# Altium schematic sheet Power_Tree.SchDoc
size A
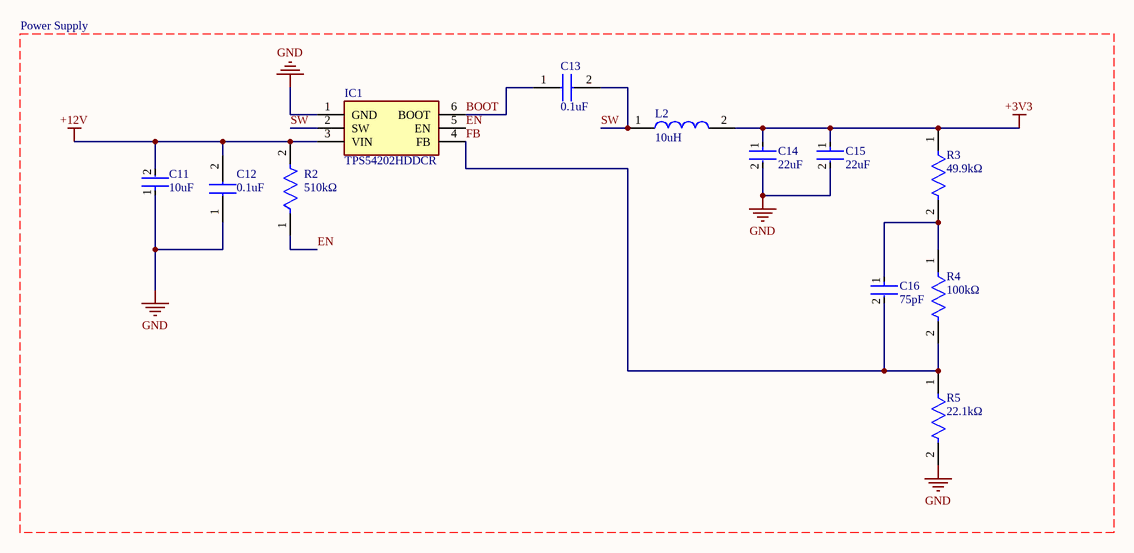
[diagram p0: Power_Tree.SchDoc]

## Parts
C11  10uF  [FP-GRT31C-0_2-IPC_A]
C12  0.1uF  [C0805]
C13  0.1uF  [C0805]
C14  22uF  [FP-1206-L_3_2_0_3-W_1_6_0-IPC_A]
C15  22uF  [FP-1206-L_3_2_0_3-W_1_6_0-IPC_A]
C16  75pF  [FP-C1206C-EB-MFG]
IC1  TPS54202HDDCR  [SOT95P280X110-6N]
L2  10uH  [SRN6045_1]
R2  510kΩ  [FP-CRCW0805-e3-IPC_B]
R3  49.9kΩ  [FP-CRCW0805-e3-IPC_C]
R4  100kΩ  [FP-CRCW0805-e3-MFG]
R5  22.1kΩ  [FP-CRCW0805-e3-IPC_C]

## Nets
+3V3: C14.1 C15.1 L2.2 R3.1
+12V: C11.2 C12.2 IC1.3(VIN) R2.2
GND: C11.1 C12.1 C14.2 C15.2 IC1.1(GND) R5.2
BOOT: C13.1 IC1.6(BOOT)
EN: IC1.5(EN) R2.1
FB: C16.2 IC1.4(FB) R4.2 R5.1
SW: C13.2 IC1.2(SW) L2.1
NetC16_1: C16.1 R3.2 R4.1

## Notes on the sheet
- Power Supply

## Library data of the parts
C11 = CMP-06035-000076-2: Multi-Layer Ceramic Capacitor 10uF 50V X5R ±10% 1206 Emboss T/R; Length: 0.126inch; Max Operating Temperature: 85°C; Width: 0.063inch; Ratings: AEC-Q200; Voltage Rating: 50V; Dielectric: X5R; Min Operating Temperature: -55°C; Case Code (Imperial): 1206; Capacitance: 10uF; Case Code (Metric): 3216; Thickness: 0.071inch; Tolerance: 10%; Mount: Surface Mount; Case/Package: 1206; Packaging: Cut Tape; Voltage Rating (DC): 50V
C12 C13 = C0805C104K6RACTU: Capacitor; Manufacturer_Name: KEMET; Datasheet Link: https://content.kemet.com/datasheets/KEM_C1002_X7R_SMD.pdf; Height: 1.1mm; Manufacturer_Part_Number: C0805C104K6RACTU; Mouser Part Number: 80-C0805C104K6R; Mouser Price/Stock: https://www.mouser.co.uk/ProductDetail/KEMET/C0805C104K6RACTU?qs=NrXEK%2Fuukt5je6JkV2NA6Q%3D%3D; Arrow Part Number: C0805C104K6RACTU; Arrow Price/Stock: https://www.arrow.com/en/products/c0805c104k6ractu/kemet-corporation?region=nac
C14 C15 = CMP-14477-000099-2: None; Tolerance: 20%; Voltage Rating: 16V; Dielectric: X7R; Lead Free: Lead Free; Min Operating Temperature: -55°C; Max Operating Temperature: 125°C; Case/Package: 1206; RoHS Compliant: Yes; Case Code (Metric): 3216; Width: 0.063inch; Case Code (Imperial): 1206; Thickness: 0.071inch; Capacitance: 22uF; Packaging: Tape and Reel; Length: 0.126inch; Mount: Surface Mount
C16 = CMP-1037-01478-2: CAP CER 75PF 50V NP0 1206; Manufacturer Part Number: C1206C750J5GACTU; Manufacturer: KEMET; Temperature Coefficient: 15%; Tolerance: 0.05; Automotive Grade: Grade 0; Temperature Characteristic: C0G; Material: Ceramic; Mouser Description: Cap Ceramic 75pF 50V C0G 5% SMD 1206 125°C Plastic T/R; Package: C1206C-EB; Device Class L1: Passive Components; Lead Free: Yes; Digikey Description: CAP CER 75PF 50V NP0 1206; Capacitance: 75 pF; Automotive: Yes; Height: 0.88mm; Value: 75 pF; ComponentLink2Description: Datasheet; Temperature Range High: +150°C; Temperature: -55°C to +150°C; Temperature Range Low: -55°C; Device Class L3: Ceramic Capacitors; Octopart: https://octopart.com/c1206c750j5gactu-kemet-9139197; Device Class L2: Capacitors; RoHS: TRUE; Category: Cap; Voltage Rating: 50 V; ComponentLink2URL: https://content.kemet.com/datasheets/KEM_C1007_X8R_ULTRA_150C_SMD.pdf; Ipc Land Pattern Name: CAPC320160X78
IC1 = TPS54202HDDCR: Integrated Circuit; Manufacturer_Name: Texas Instruments; Datasheet Link: http://www.ti.com/lit/gpn/tps54202h; Height: 1.1mm; Manufacturer_Part_Number: TPS54202HDDCR; Mouser Part Number: 595-TPS54202HDDCR; Mouser Price/Stock: https://www.mouser.co.uk/ProductDetail/Texas-Instruments/TPS54202HDDCR?qs=uP22XH7NdCtzy%252BOdxI8qhQ%3D%3D; Arrow Part Number: TPS54202HDDCR; Arrow Price/Stock: https://www.arrow.com/en/products/tps54202hddcr/texas-instruments?region=nac
L2 = SRN6045-100M: Inductor; Manufacturer_Name: Bourns; Datasheet Link: https://componentsearchengine.com/Datasheets/2/SRN6045-100M.pdf; Manufacturer_Part_Number: SRN6045-100M; Mouser Part Number: 652-SRN6045-100M; Mouser Price/Stock: https://www.mouser.co.uk/ProductDetail/Bourns/SRN6045-100M?qs=opBjA1TV900pBUPQKVevSA%3D%3D; Arrow Part Number: SRN6045-100M; Arrow Price/Stock: https://www.arrow.com/en/products/srn6045-100m/bourns?region=nac
R2 = CMP-2001-03987-2: RES Thick Film, 510kΩ, 1%, 0.125W, 100ppm/°C, 0805; Power Rating: 125mW; Voltage Rating (DC): 150V; Resistance: 510kR; Length: 2mm; Min Operating Temperature: -55°C; Package Quantity: 10; Tolerance: 1%; Width: 1.25mm; Contact Plating: Tin; Mount: Surface Mount; Voltage Rating: 150V; Temperature Coefficient: 100ppm/°C; Radiation Hardening: No; Case/Package: 0805; Max Power Dissipation: 125mW; Military Standard: Not; Case Code (Imperial): 0805; Lead Free: Lead Free; Height: 0.45mm; Termination: SMD/SMT; Packaging: Tape and Reel; Depth: 1.25mm; Features: Automotive AEC-Q200; Weight: 0.000194oz; Max Operating Temperature: 155°C; Composition: Thick Film; Case Code (Metric): 2012; Number of Pins: 2; Number of Terminations: 2
R3 = CMP-2001-03952-2: RES Thick Film, 49.9kΩ, 1%, 0.125W, 100ppm/°C, 0805; Resistance: 49.9kR; Power Rating: 125mW; Voltage Rating (DC): 150V; Contact Plating: Tin; Case Code (Imperial): 0805; Package Quantity: 10; Termination: SMD/SMT; Length: 2mm; Width: 0.049inch; Case Code (Metric): 2012; Temperature Coefficient: 100ppm/°C; Tolerance: 1%; Depth: 1.25mm; Mount: Surface Mount; Lead Free: Lead Free; Min Operating Temperature: -55°C; Case/Package: 0805; Number of Terminations: 2; Composition: Thick Film; Height: 0.45mm; Voltage Rating: 150V; Max Power Dissipation: 125mW; Features: Automotive AEC-Q200; Military Standard: Not; Radiation Hardening: No; Max Operating Temperature: 155°C; Weight: 0.000194oz; Packaging: Tape and Reel
R4 = CMP-2001-04899-2: RES Thick Film, 100kΩ, 1%, 0.125W, 100ppm/°C, 0805; Resistance: 100kR; Power Rating: 125mW; Voltage Rating: 150V; Case/Package: 0805; Max Operating Temperature: 155°C; Case Code (Imperial): 0805; Lead Free: Lead Free; Weight: 0.000194oz; Number of Pins: 2; Package Quantity: 5000; Height: 0.45mm; Composition: Thick Film; Military Standard: Not; Tolerance: 1%; Case Code (Metric): 2012; Termination: SMD/SMT; Mount: Surface Mount; Radiation Hardening: No; Width: 1.25mm; Length: 2mm; Depth: 1.25mm; Packaging: Tape and Reel; Min Operating Temperature: -55°C; Contact Plating: Tin; Temperature Coefficient: 100ppm/°C; Voltage Rating (DC): 150V
R5 = CMP-2001-03689-2: RES Thick Film, 22.1kΩ, 1%, 0.125W, 100ppm/°C, 0805; Voltage Rating (DC): 150V; Max Power Dissipation: 125mW; Resistance: 22.1kR; Voltage Rating: 150V; Height: 0.45mm; Packaging: Tape and Reel; Lead Free: Lead Free; Composition: Thick Film; Temperature Coefficient: 100ppm/°C; Depth: 1.25mm; Length: 2mm; Case Code (Metric): 2012; Number of Terminations: 2; Case/Package: 0805; Termination: SMD/SMT; Power Rating: 125mW; Package Quantity: 10; Max Operating Temperature: 155°C; Radiation Hardening: No; Width: 1.25mm; Military Standard: Not; Weight: 0.000194oz; Contact Plating: Tin; Min Operating Temperature: -55°C; Features: Automotive AEC-Q200; Case Code (Imperial): 0805; Tolerance: 1%